# Altium schematic sheet LED Control A4-A7.SchDoc
size A4
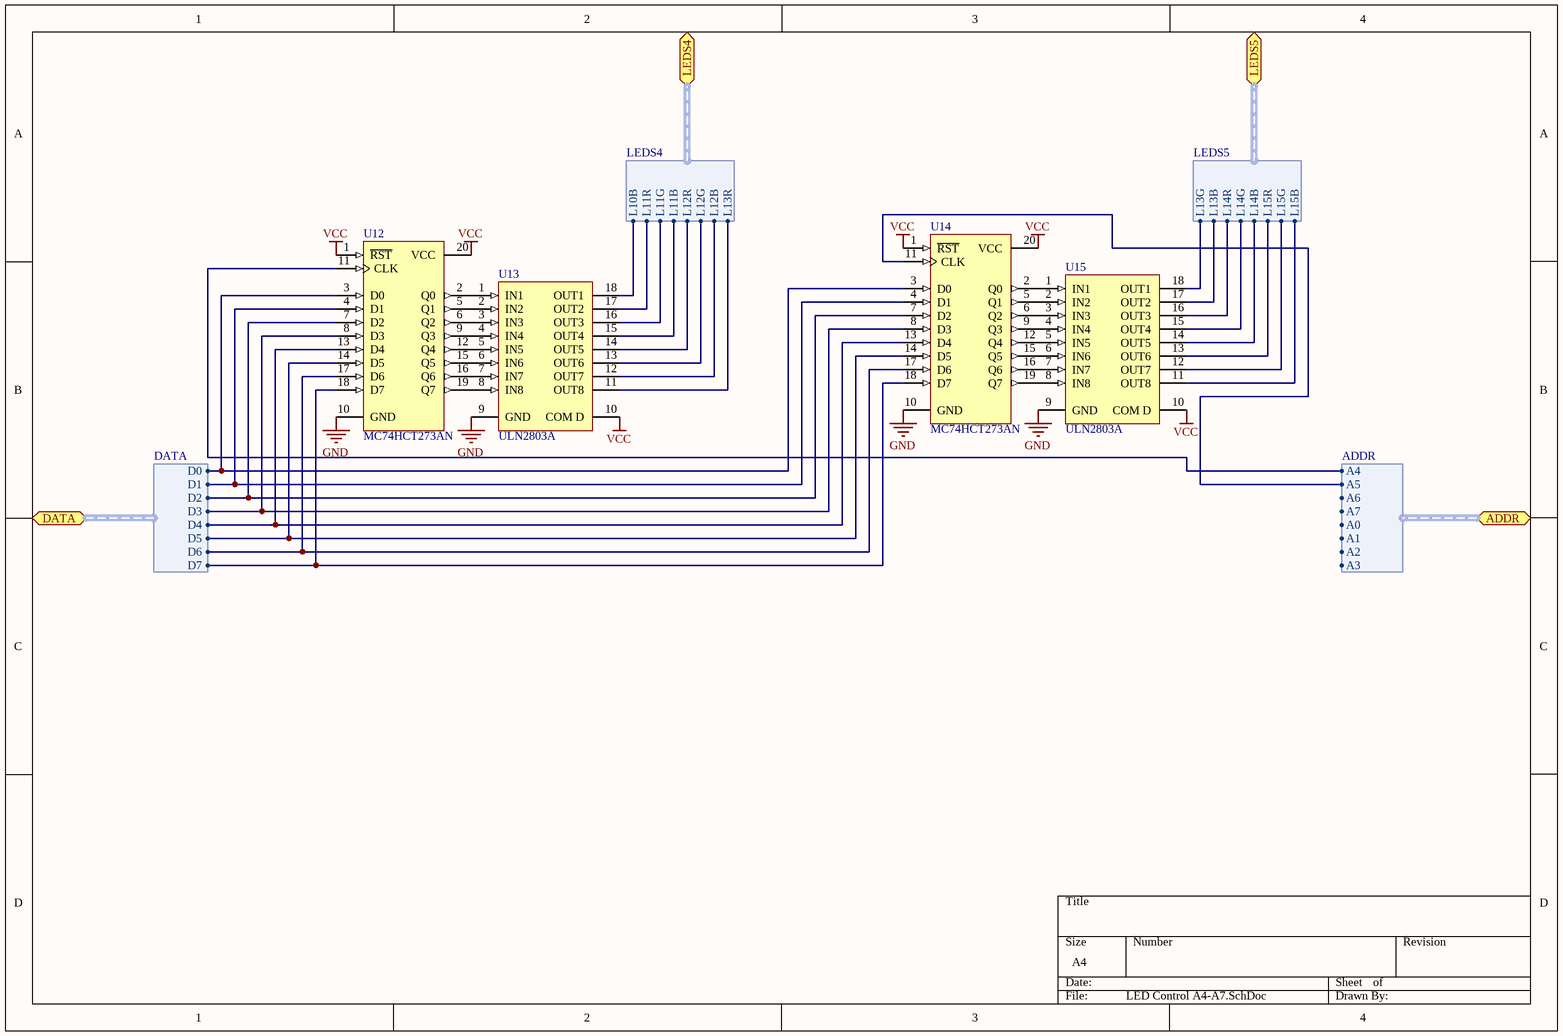
[diagram p0: LED Control A4-A7.SchDoc]

## Parts
U12  MC74HCT273AN  [738-03]
U13  ULN2803A  [DIP18]
U14  MC74HCT273AN  [738-03]
U15  ULN2803A  [DIP18]

## Ports
ADDR (harness ADDR), DATA (harness DATA), LEDS4 (harness LEDS4), LEDS5 (harness LEDS5)

## Harnesses
DATA: D7, D6, D5, D4, D3, D2, D1, D0
LEDS4: L10B, L11R, L11G, L11B, L12R, L12G, L12B, L13R
LEDS5: L13G, L13B, L14R, L14G, L14B, L15R, L15G, L15B
ADDR: A7, A6, A5, A4, A0, A1, A2, A3

## Nets
GND: U12.10(GND) U13.9(GND) U14.10(GND) U15.9(GND)
VCC: U12.1(~{RST}) U12.20(VCC) U13.10(COM_D) U14.1(~{RST}) U14.20(VCC) U15.10(COM_D)
NetU12_2: U12.2(Q0) U13.1(IN1)
NetU12_3: U12.3(D0) U14.3(D0) ; port DATA.D0
NetU12_4: U12.4(D1) U14.4(D1) ; port DATA.D1
NetU12_5: U12.5(Q1) U13.2(IN2)
NetU12_6: U12.6(Q2) U13.3(IN3)
NetU12_7: U12.7(D2) U14.7(D2) ; port DATA.D2
NetU12_8: U12.8(D3) U14.8(D3) ; port DATA.D3
NetU12_9: U12.9(Q3) U13.4(IN4)
NetU12_11: U12.11(CLK) ; port ADDR.A4
NetU12_12: U12.12(Q4) U13.5(IN5)
NetU12_13: U12.13(D4) U14.13(D4) ; port DATA.D4
NetU12_14: U12.14(D5) U14.14(D5) ; port DATA.D5
NetU12_15: U12.15(Q5) U13.6(IN6)
NetU12_16: U12.16(Q6) U13.7(IN7)
NetU12_17: U12.17(D6) U14.17(D6) ; port DATA.D6
NetU12_18: U12.18(D7) U14.18(D7) ; port DATA.D7
NetU12_19: U12.19(Q7) U13.8(IN8)
NetU13_11: U13.11(OUT8) ; port LEDS4.L13R
NetU13_12: U13.12(OUT7) ; port LEDS4.L12B
NetU13_13: U13.13(OUT6) ; port LEDS4.L12G
NetU13_14: U13.14(OUT5) ; port LEDS4.L12R
NetU13_15: U13.15(OUT4) ; port LEDS4.L11B
NetU13_16: U13.16(OUT3) ; port LEDS4.L11G
NetU13_17: U13.17(OUT2) ; port LEDS4.L11R
NetU13_18: U13.18(OUT1) ; port LEDS4.L10B
NetU14_2: U14.2(Q0) U15.1(IN1)
NetU14_5: U14.5(Q1) U15.2(IN2)
NetU14_6: U14.6(Q2) U15.3(IN3)
NetU14_9: U14.9(Q3) U15.4(IN4)
NetU14_11: U14.11(CLK) ; port ADDR.A5
NetU14_12: U14.12(Q4) U15.5(IN5)
NetU14_15: U14.15(Q5) U15.6(IN6)
NetU14_16: U14.16(Q6) U15.7(IN7)
NetU14_19: U14.19(Q7) U15.8(IN8)
NetU15_11: U15.11(OUT8) ; port LEDS5.L15B
NetU15_12: U15.12(OUT7) ; port LEDS5.L15G
NetU15_13: U15.13(OUT6) ; port LEDS5.L15R
NetU15_14: U15.14(OUT5) ; port LEDS5.L14B
NetU15_15: U15.15(OUT4) ; port LEDS5.L14G
NetU15_16: U15.16(OUT3) ; port LEDS5.L14R
NetU15_17: U15.17(OUT2) ; port LEDS5.L13B
NetU15_18: U15.18(OUT1) ; port LEDS5.L13G

## Library data of the parts
U12 U14 = MC74HCT273AN: Octal D-Type Flip-Flop with Common Clock and Reset with LSTTL-Compatible Inputs; Published: 15-Apr-2002; DatasheetVersion: Mar-2000; PackageVersion: 1996; PackageReference: 738-03; Publisher: Altium Limited; PackageDescription: DIP; 20 Leads; Row Spacing 7.62 mm; Pitch 2.54 mm; Code_JEDEC: MS-001-AD; ComponentLink1Description: Manufacturer Link; ComponentLink1URL: http://www.onsemi.com/; ComponentLink2Description: Datasheet; ComponentLink2URL: http://www.onsemi.com/pub/Collateral/MC74HCT273A-D.PDF
U13 U15 = ULN2803A: Eight Darlington Array; Published: 8-Jun-2000; LatestRevisionDate: 06-Jun-2005; LatestRevisionNote: Stylized 3D Model Added.; DatasheetVersion: Sep-1997; PackageReference: DIP18; Publisher: Altium Limited; PackageDescription: DIP; 18 Leads; Row Spacing 7.62 mm; Pitch 2.54 mm; ComponentLink1Description: Manufacturer Link; ComponentLink1URL: http://www.st.com/; ComponentLink2Description: Datasheet; ComponentLink2URL: http://www.st.com/stonline/products/literature/ds/1536/uln2801a.pdf